# Altium schematic sheet motordriver.SchDoc
size A4; SheetNumber: 4; SheetTotal: 6
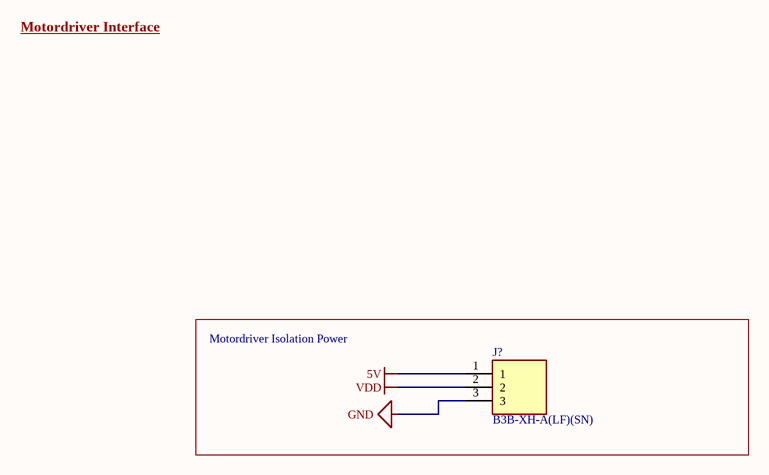
[diagram p0: motordriver.SchDoc]

## Parts
J?  B3B-XH-A(LF)(SN)  [JST_B3B-XH-A(LF)(SN)]

## Blocks framed on the sheet
Motordriver Isolation Power: J?

## Nets
5V: J?.1
GND: J?.3
VDD: J?.2

## Notes on the sheet
- Motordriver Interface

## Library data of the parts
J? = CN 3POS TH JSTXH: CN 3POS TH JST XH; MF: JST Sales; Package: None; SnapEDA_Link: https://www.snapeda.com/parts/B3B-XH-A(LF)(SN)/JST%20Sales%20America%20Inc./view-part/231271/?ref=snap; DigiKey-Purchase-URL: https://snapeda.com/shop?store=DigiKey&id=231271; MP: B3B-XH-A(LF)(SN); Price: None; Availability: Warning; Value: *